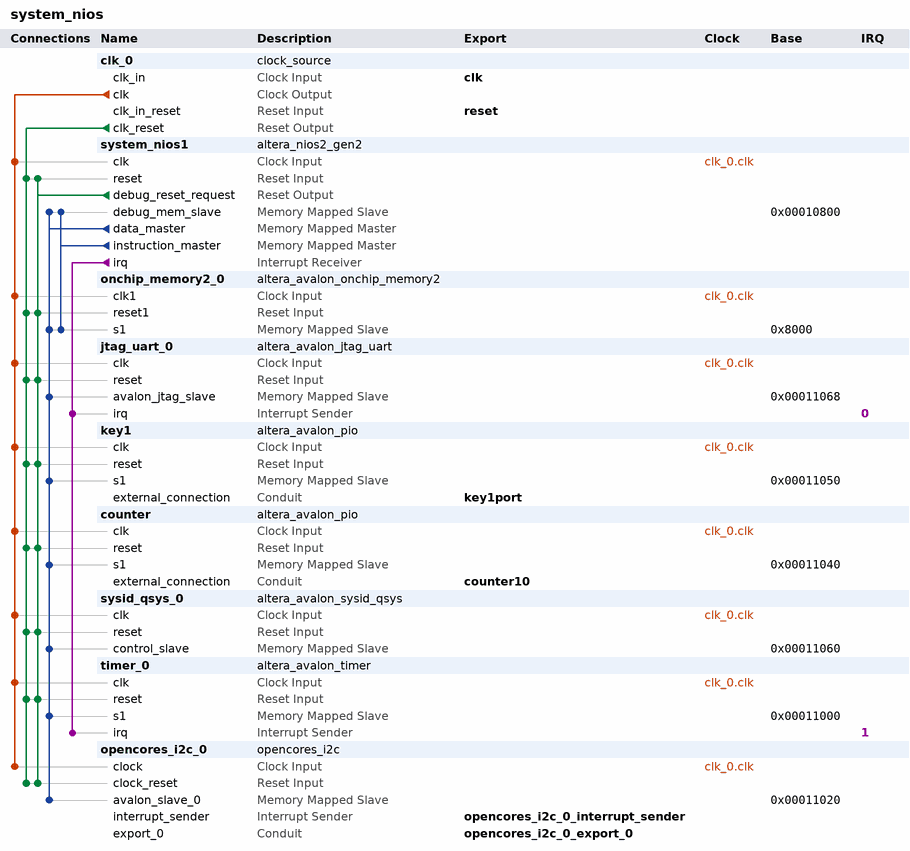
[diagram p0: system contents]
# Platform Designer (Qsys) system system_nios, MAX 10 10M50DAF484C7G
# Parameters at their usual value, and those the tool derives, are not listed.
package require -exact qsys 18.1
create_system system_nios
set_project_property DEVICE_FAMILY {MAX 10}
set_project_property DEVICE 10M50DAF484C7G

add_instance clk_0 clock_source 18.1
set_instance_parameter_value clk_0 clockFrequency 50000000

add_instance system_nios1 altera_nios2_gen2 18.1
set_instance_parameter_value system_nios1 dcache_size 2048
set_instance_parameter_value system_nios1 exceptionSlave onchip_memory2_0.s1
set_instance_parameter_value system_nios1 icache_size 4096
set_instance_parameter_value system_nios1 impl Fast
set_instance_parameter_value system_nios1 resetSlave onchip_memory2_0.s1

add_instance onchip_memory2_0 altera_avalon_onchip_memory2 18.1
set_instance_parameter_value onchip_memory2_0 dataWidth 32
set_instance_parameter_value onchip_memory2_0 dualPort false
set_instance_parameter_value onchip_memory2_0 initMemContent true
set_instance_parameter_value onchip_memory2_0 initializationFileName onchip_mem.hex
set_instance_parameter_value onchip_memory2_0 memorySize 20480

add_instance jtag_uart_0 altera_avalon_jtag_uart 18.1
set_instance_parameter_value jtag_uart_0 simInteractiveOptions NO_INTERACTIVE_WINDOWS

add_instance key1 altera_avalon_pio 18.1
set_instance_parameter_value key1 direction Input
set_instance_parameter_value key1 width 1

add_instance counter altera_avalon_pio 18.1
set_instance_parameter_value counter direction Output
set_instance_parameter_value counter width 24

add_instance sysid_qsys_0 altera_avalon_sysid_qsys 18.1
set_instance_parameter_value sysid_qsys_0 id 0

add_instance timer_0 altera_avalon_timer 18.1
set_instance_parameter_value timer_0 period 1
set_instance_parameter_value timer_0 periodUnits MSEC

add_instance opencores_i2c_0 opencores_i2c 9.1

# connections
add_connection clk_0.clk counter.clk clock
add_connection clk_0.clk jtag_uart_0.clk clock
add_connection clk_0.clk key1.clk clock
add_connection clk_0.clk onchip_memory2_0.clk1 clock
add_connection clk_0.clk opencores_i2c_0.clock clock
add_connection clk_0.clk sysid_qsys_0.clk clock
add_connection clk_0.clk system_nios1.clk clock
add_connection clk_0.clk timer_0.clk clock
add_connection clk_0.clk_reset counter.reset reset
add_connection clk_0.clk_reset jtag_uart_0.reset reset
add_connection clk_0.clk_reset key1.reset reset
add_connection clk_0.clk_reset onchip_memory2_0.reset1 reset
add_connection clk_0.clk_reset opencores_i2c_0.clock_reset reset
add_connection clk_0.clk_reset sysid_qsys_0.reset reset
add_connection clk_0.clk_reset system_nios1.reset reset
add_connection clk_0.clk_reset timer_0.reset reset
add_connection system_nios1.debug_reset_request counter.reset reset
add_connection system_nios1.debug_reset_request jtag_uart_0.reset reset
add_connection system_nios1.debug_reset_request key1.reset reset
add_connection system_nios1.debug_reset_request onchip_memory2_0.reset1 reset
add_connection system_nios1.debug_reset_request opencores_i2c_0.clock_reset reset
add_connection system_nios1.debug_reset_request sysid_qsys_0.reset reset
add_connection system_nios1.debug_reset_request system_nios1.reset reset
add_connection system_nios1.debug_reset_request timer_0.reset reset
add_connection system_nios1.data_master counter.s1 avalon
set_connection_parameter_value system_nios1.data_master/counter.s1 baseAddress 0x00011040
add_connection system_nios1.data_master jtag_uart_0.avalon_jtag_slave avalon
set_connection_parameter_value system_nios1.data_master/jtag_uart_0.avalon_jtag_slave baseAddress 0x00011068
add_connection system_nios1.data_master key1.s1 avalon
set_connection_parameter_value system_nios1.data_master/key1.s1 baseAddress 0x00011050
add_connection system_nios1.data_master onchip_memory2_0.s1 avalon
set_connection_parameter_value system_nios1.data_master/onchip_memory2_0.s1 baseAddress 0x8000
add_connection system_nios1.data_master opencores_i2c_0.avalon_slave_0 avalon
set_connection_parameter_value system_nios1.data_master/opencores_i2c_0.avalon_slave_0 baseAddress 0x00011020
add_connection system_nios1.data_master sysid_qsys_0.control_slave avalon
set_connection_parameter_value system_nios1.data_master/sysid_qsys_0.control_slave baseAddress 0x00011060
add_connection system_nios1.data_master system_nios1.debug_mem_slave avalon
set_connection_parameter_value system_nios1.data_master/system_nios1.debug_mem_slave baseAddress 0x00010800
add_connection system_nios1.data_master timer_0.s1 avalon
set_connection_parameter_value system_nios1.data_master/timer_0.s1 baseAddress 0x00011000
add_connection system_nios1.instruction_master onchip_memory2_0.s1 avalon
set_connection_parameter_value system_nios1.instruction_master/onchip_memory2_0.s1 baseAddress 0x8000
add_connection system_nios1.instruction_master system_nios1.debug_mem_slave avalon
set_connection_parameter_value system_nios1.instruction_master/system_nios1.debug_mem_slave baseAddress 0x00010800
add_connection system_nios1.irq jtag_uart_0.irq interrupt
set_connection_parameter_value system_nios1.irq/jtag_uart_0.irq irqNumber 0
add_connection system_nios1.irq timer_0.irq interrupt
set_connection_parameter_value system_nios1.irq/timer_0.irq irqNumber 1

# exported interfaces
add_interface clk clock sink
set_interface_property clk EXPORT_OF clk_0.clk_in
add_interface counter10 conduit end
set_interface_property counter10 EXPORT_OF counter.external_connection
add_interface key1port conduit end
set_interface_property key1port EXPORT_OF key1.external_connection
add_interface opencores_i2c_0_export_0 conduit end
set_interface_property opencores_i2c_0_export_0 EXPORT_OF opencores_i2c_0.export_0
add_interface opencores_i2c_0_interrupt_sender interrupt sender
set_interface_property opencores_i2c_0_interrupt_sender EXPORT_OF opencores_i2c_0.interrupt_sender
add_interface reset reset sink
set_interface_property reset EXPORT_OF clk_0.clk_in_reset

set_interconnect_requirement {$system} qsys_mm.clockCrossingAdapter HANDSHAKE
set_interconnect_requirement {$system} qsys_mm.enableEccProtection FALSE
set_interconnect_requirement {$system} qsys_mm.insertDefaultSlave FALSE
set_interconnect_requirement {$system} qsys_mm.maxAdditionalLatency 1

save_system system_nios.qsys
